# EAGLE design 11_JNZ (EAGLE 7.5.0)
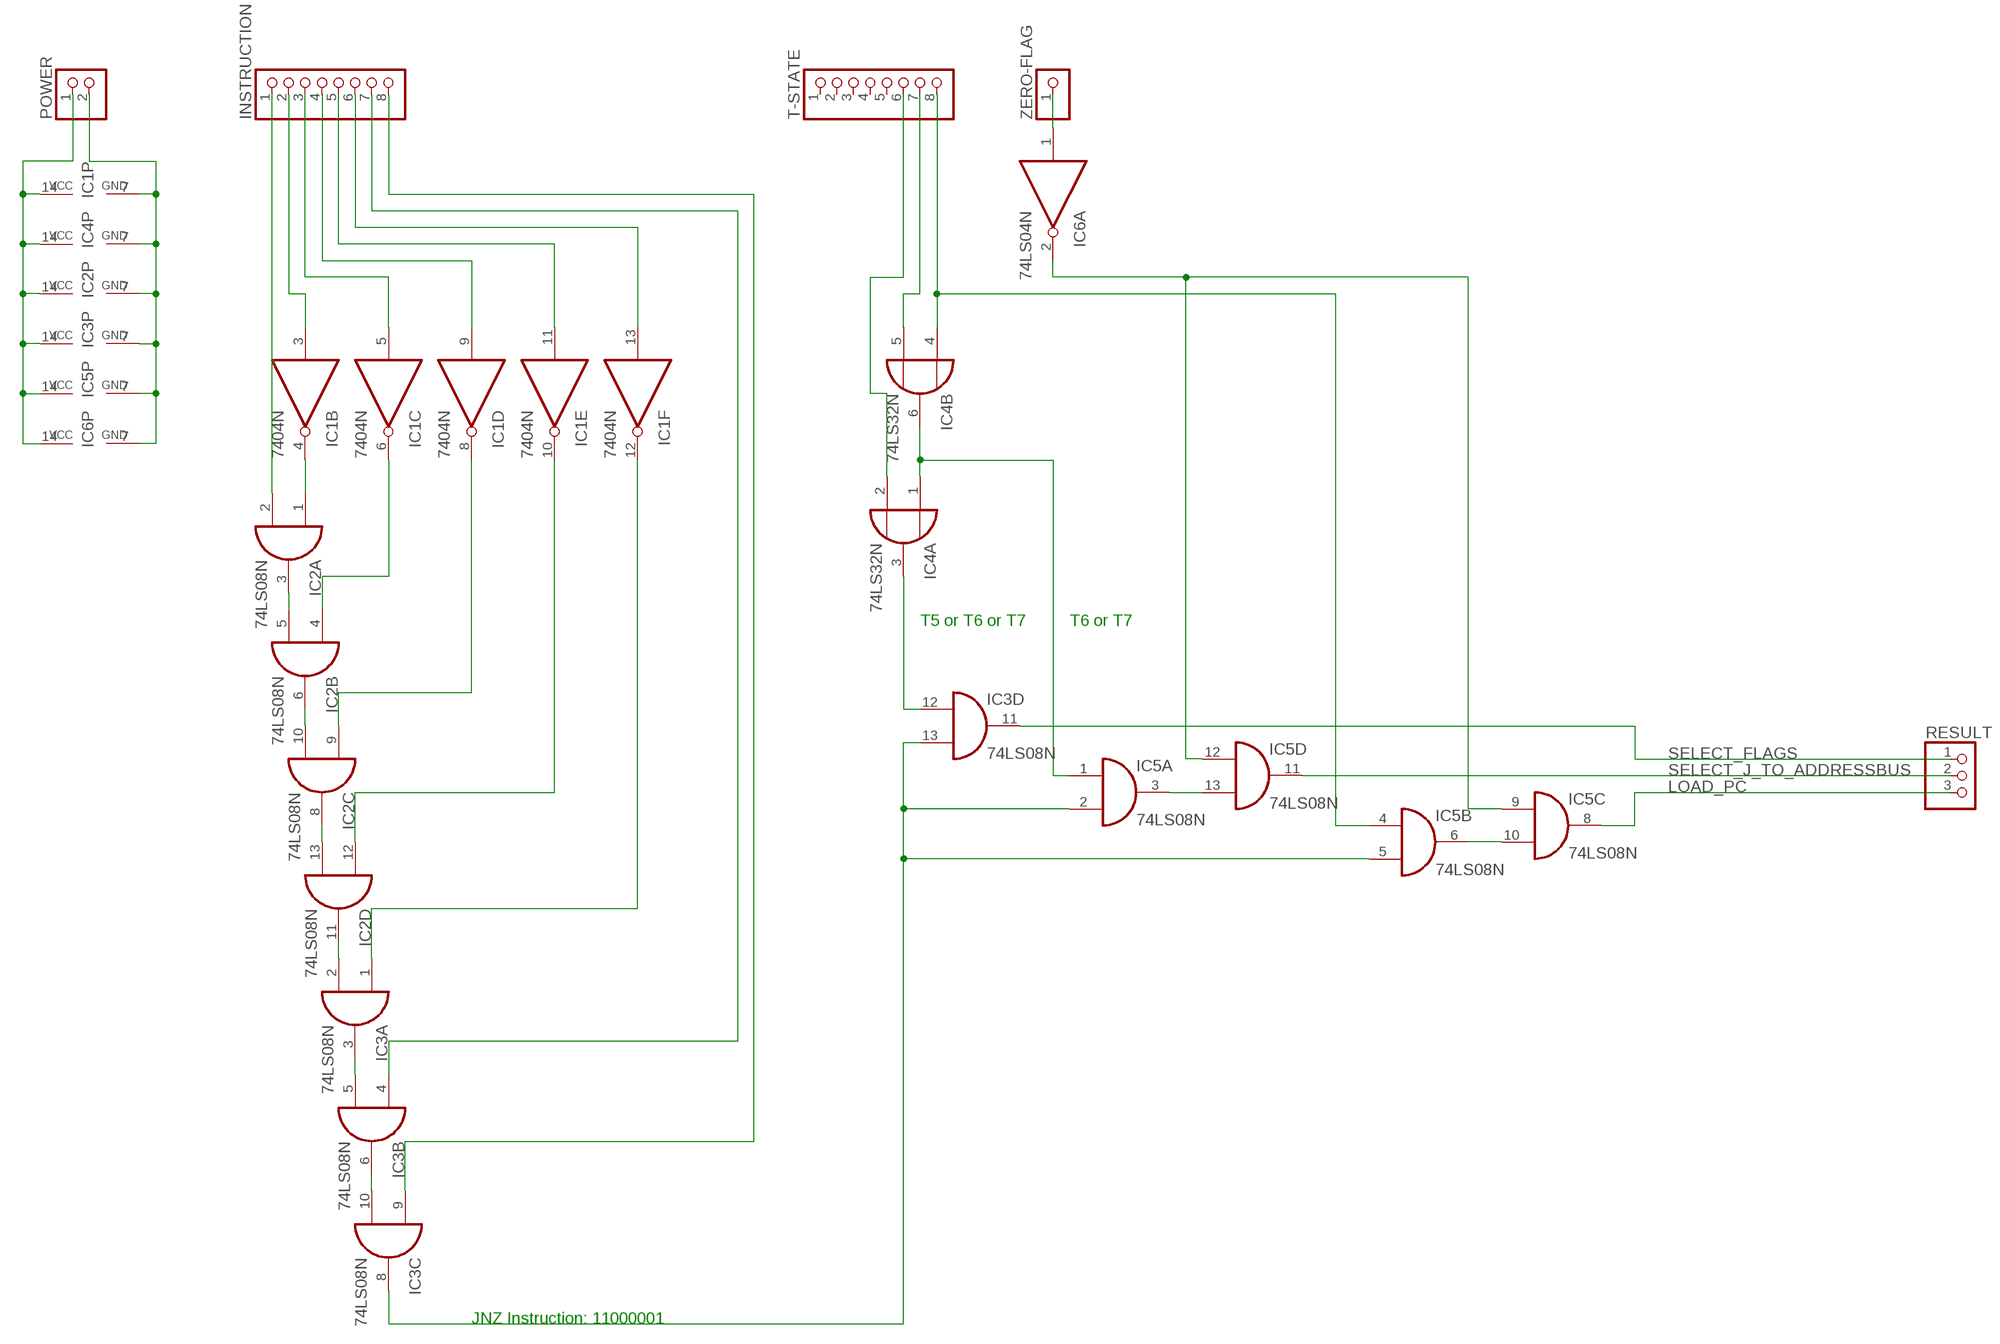
[diagram p0: schematic, sheet 1]

## Parts
IC1  7404N  [DIL14]
IC2  74LS08N  [DIL14]
IC3  74LS08N  [DIL14]
IC4  74LS32N  [DIL14]
IC5  74LS08N  [DIL14]
IC6  74LS04N  [DIL14]
INSTRUCTION  PINHD-1X8  [1X08]
POWER  PINHD-1X2  [1X02]
RESULT  PINHD-1X3  [1X03]
T-STATE  PINHD-1X8  [1X08]
ZERO-FLAG  PINHD-1X1  [1X01]

## Nets
GND: IC1.7(P:GND) IC2.7(P:GND) IC3.7(P:GND) IC4.7(P:GND) IC5.7(P:GND) IC6.7(P:GND) POWER.2
LOAD_PC: IC5.8(C:O) RESULT.3
N$1: IC6.1(A:I) ZERO-FLAG.1
N$2: IC1.3(B:I) INSTRUCTION.2
N$3: IC1.5(C:I) INSTRUCTION.3
N$4: IC1.9(D:I) INSTRUCTION.4
N$5: IC1.11(E:I) INSTRUCTION.5
N$6: IC1.13(F:I) INSTRUCTION.6
N$7: IC3.4(B:I0) INSTRUCTION.7
N$8: IC3.9(C:I0) INSTRUCTION.8
N$9: IC2.2(A:I1) INSTRUCTION.1
N$10: IC1.4(B:O) IC2.1(A:I0)
N$11: IC2.3(A:O) IC2.5(B:I1)
N$12: IC1.6(C:O) IC2.4(B:I0)
N$13: IC2.6(B:O) IC2.10(C:I1)
N$14: IC1.8(D:O) IC2.9(C:I0)
N$15: IC2.8(C:O) IC2.13(D:I1)
N$16: IC1.10(E:O) IC2.12(D:I0)
N$17: IC2.11(D:O) IC3.2(A:I1)
N$18: IC3.3(A:O) IC3.5(B:I1)
N$19: IC1.12(F:O) IC3.1(A:I0)
N$20: IC3.6(B:O) IC3.10(C:I1)
N$21: IC5.6(B:O) IC5.10(C:I1)
N$22: IC3.8(C:O) IC3.13(D:I1) IC5.2(A:I1) IC5.5(B:I1)
N$23: IC4.4(B:I0) IC5.4(B:I0) T-STATE.8
N$24: IC4.5(B:I1) T-STATE.7
N$25: IC4.1(A:I0) IC4.6(B:O) IC5.1(A:I0)
N$26: IC4.2(A:I1) T-STATE.6
N$27: IC3.12(D:I0) IC4.3(A:O)
N$28: IC5.9(C:I0) IC5.12(D:I0) IC6.2(A:O)
N$29: IC5.3(A:O) IC5.13(D:I1)
SELECT_FLAGS: IC3.11(D:O) RESULT.1
SELECT_J_TO_ADDRESSBUS: IC5.11(D:O) RESULT.2
VCC: IC1.14(P:VCC) IC2.14(P:VCC) IC3.14(P:VCC) IC4.14(P:VCC) IC5.14(P:VCC) IC6.14(P:VCC) POWER.1
Unconnected: IC1.1(A:I) IC1.2(A:O) IC4.8(C:O) IC4.9(C:I0) IC4.10(C:I1) IC4.11(D:O) IC4.12(D:I0) IC4.13(D:I1) IC6.3(B:I) IC6.4(B:O) IC6.5(C:I) IC6.6(C:O) IC6.8(D:O) IC6.9(D:I) IC6.10(E:O) IC6.11(E:I) IC6.12(F:O) IC6.13(F:I) T-STATE.1 T-STATE.2 T-STATE.3 T-STATE.4 T-STATE.5

## Notes on the sheet
- T5 or T6 or T7 | T6 or T7
- JNZ Instruction: 11000001

## Library data of the parts
IC1 IC6 = 74xx-eu:74*04: Hex INVERTER
IC2 IC3 IC5 = 74xx-eu:74*08: Quad 2-input AND gate
IC4 = 74xx-eu:74*32: Quad 2-input OR gate
INSTRUCTION T-STATE = pinhead:PINHD-1X8: PIN HEADER
POWER = pinhead:PINHD-1X2: PIN HEADER
RESULT = pinhead:PINHD-1X3: PIN HEADER
ZERO-FLAG = pinhead:PINHD-1X1: PIN HEADER

## Board
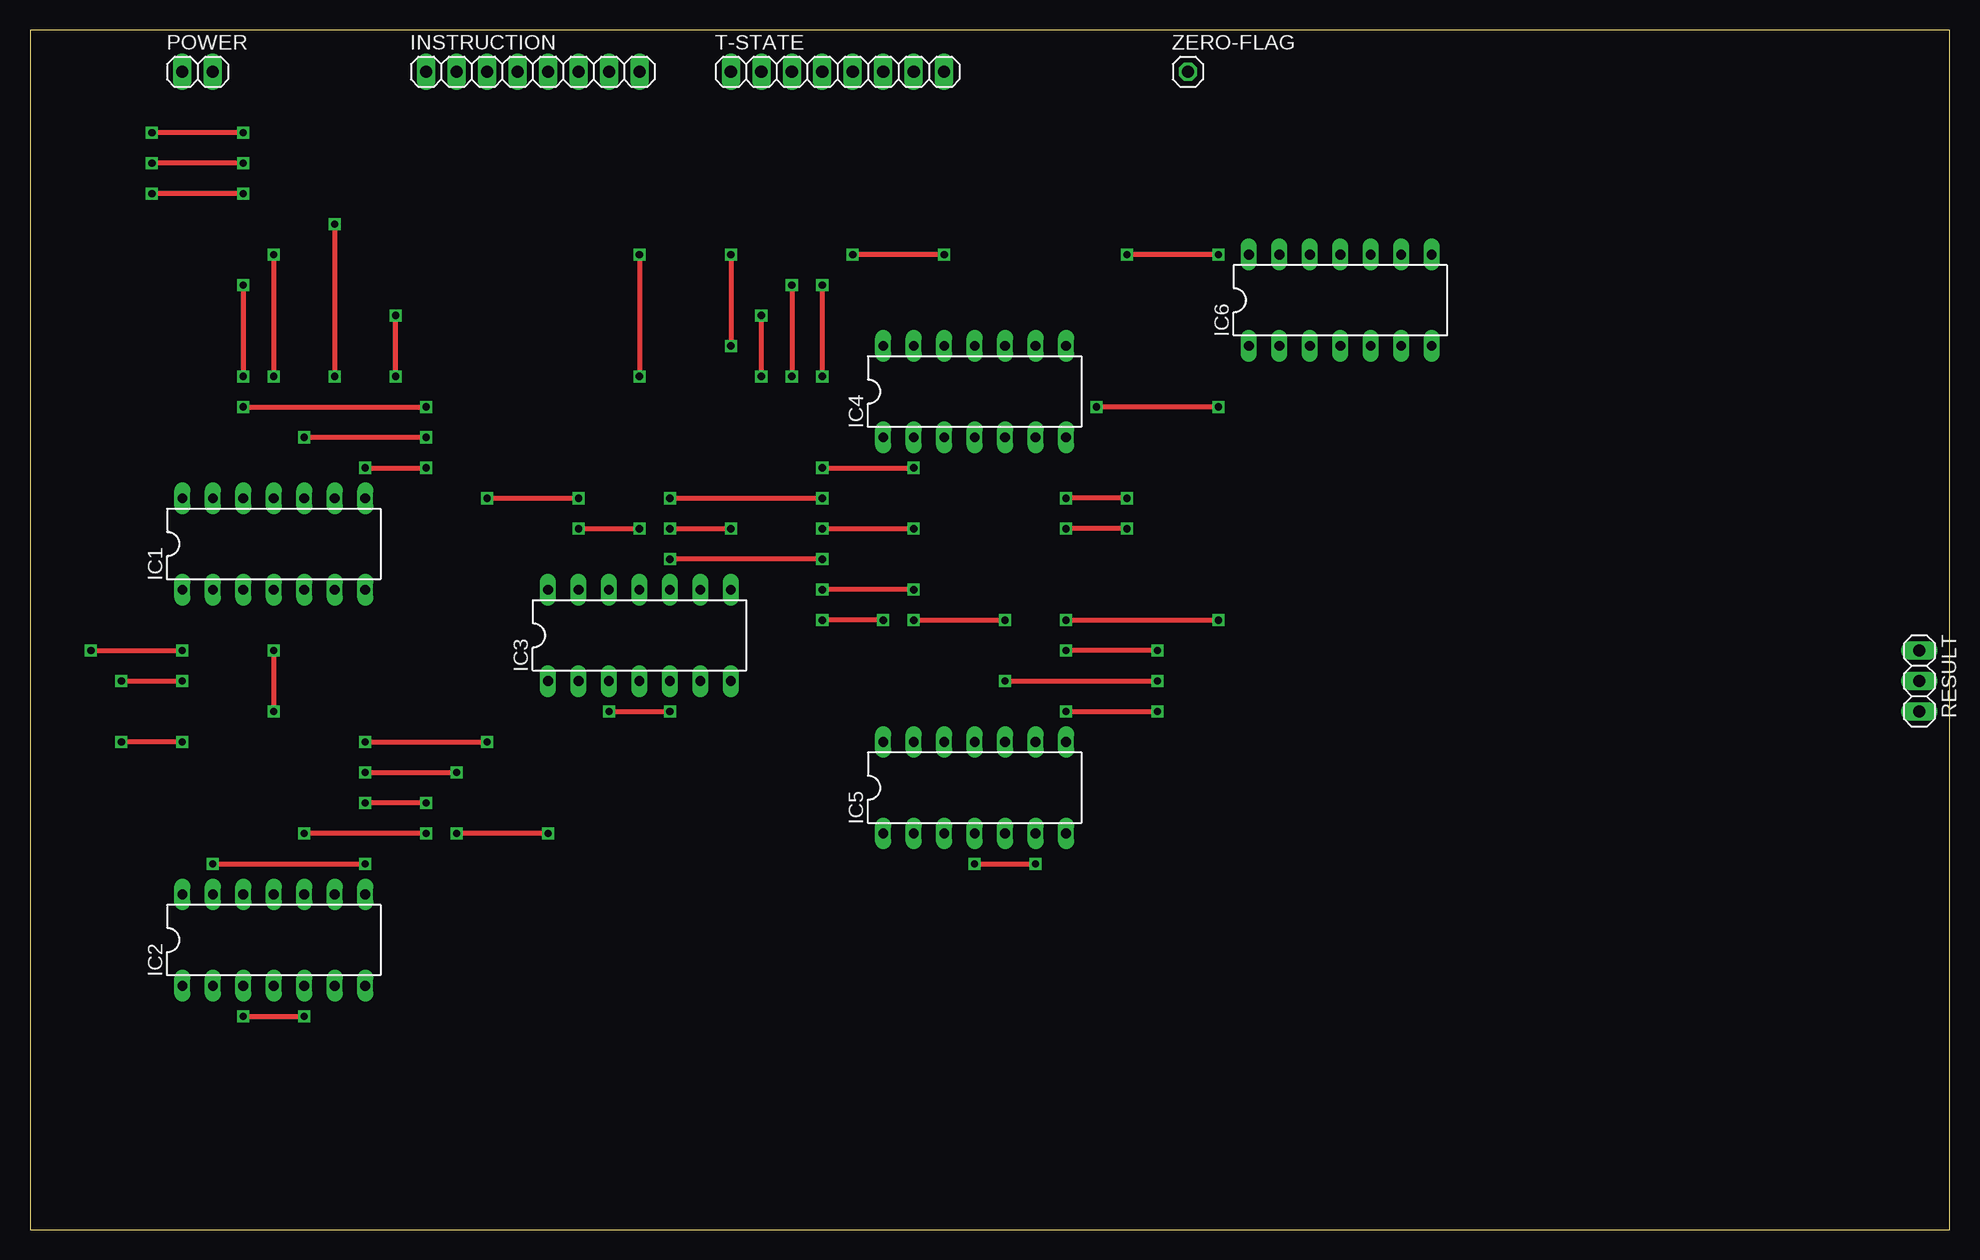
[diagram p1: board, top side]
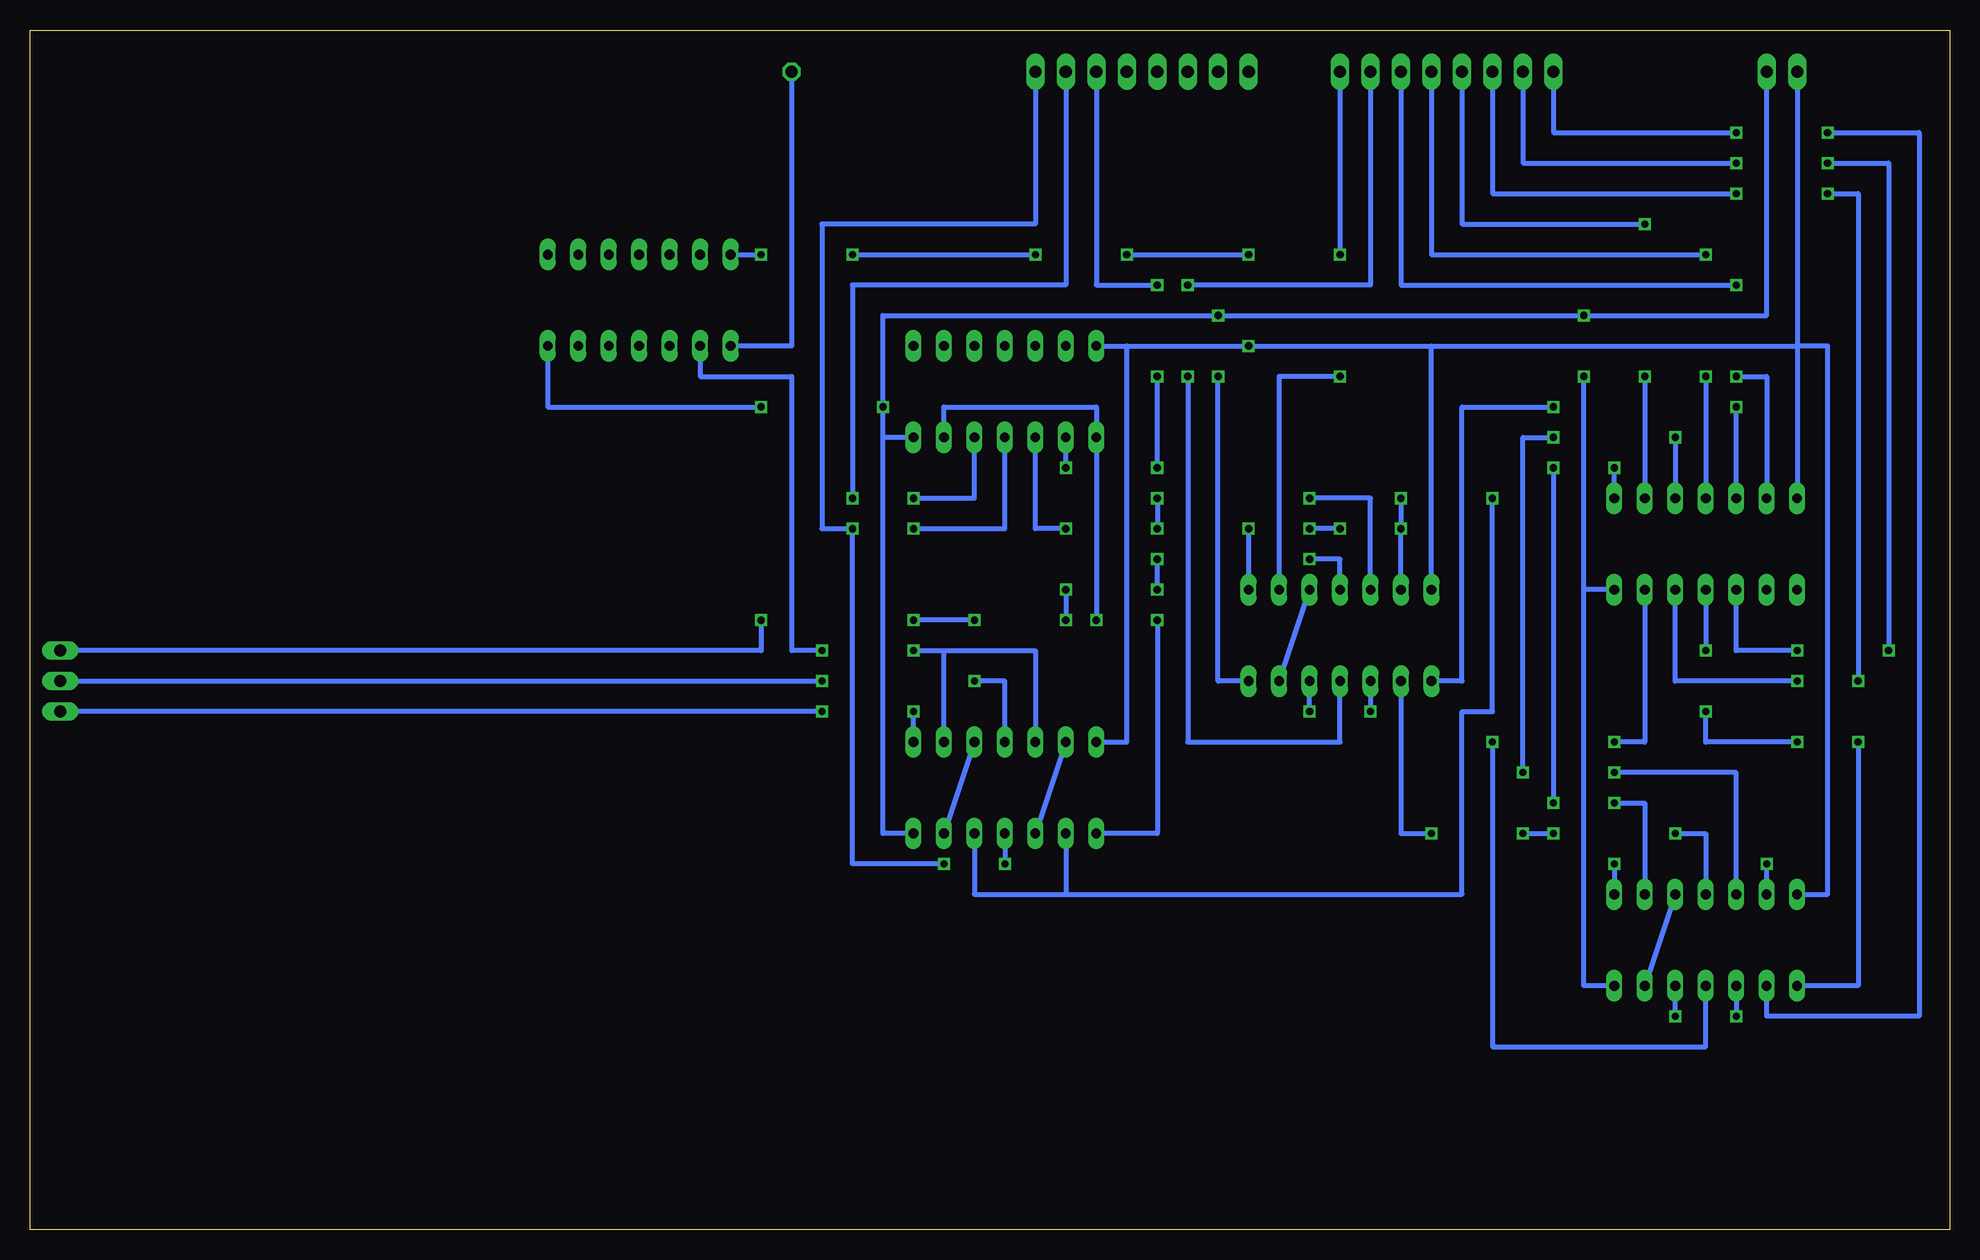
[diagram p2: board, bottom side, seen from below]

Size 160 x 100 mm. Coordinates in mm from the lower left corner, seen from the top.
Outline: 0,0 160,0 160,100 0,100 0,0
Copper layers (1*16): Top 0.035mm / dielectric 1.5mm / Bottom 0.035mm
Design rules "default": minimum track width 10mil, minimum drill 24mil, track to track 8mil, track to pad 8mil, pad to pad 8mil, via to via 8mil, smd to smd 8mil, copper to edge 40mil, drill to drill 8mil, minimum pad ring 10mil, minimum via ring 8mil, stop-mask expansion 4mil, vias tented up to drill 0mil, thermal gap 10mil

### Footprints (pad centres in the part's own frame; a part is rotated, then mirrored left to right if it is on the bottom)
DIL14 = drill 0.813 long: 1 -7.62,-3.81; 2 -5.08,-3.81; 3 -2.54,-3.81; 4 0,-3.81; 5 2.54,-3.81; 6 5.08,-3.81; 7 7.62,-3.81; 8 7.62,3.81; 9 5.08,3.81; 10 2.54,3.81; 11 0,3.81; 12 -2.54,3.81; 13 -5.08,3.81; 14 -7.62,3.81
1X08 = drill 1.016 long: 1 -8.89,0; 2 -6.35,0; 3 -3.81,0; 4 -1.27,0; 5 1.27,0; 6 3.81,0; 7 6.35,0; 8 8.89,0
1X02 = drill 1.016 long: 1 -1.27,0; 2 1.27,0
1X03 = drill 1.016 long: 1 -2.54,0; 2 0,0; 3 2.54,0
1X01 = drill 1.016 octagon: 1 0,0

### Placement (x,y rotation side)
IC1  20.32,57.15 0 top
IC2  20.32,24.13 0 top
IC3  50.8,49.53 0 top
IC4  78.74,69.85 0 top
IC5  78.74,36.83 0 top
IC6  109.22,77.47 0 top
INSTRUCTION  41.91,96.52 0 top
POWER  13.97,96.52 0 top
RESULT  157.48,45.72 270 top
T-STATE  67.31,96.52 0 top
ZERO-FLAG  96.52,96.52 0 top

### Tracks (layer width: path | path; a pad name or v marks a point on that pad's centre or on a via)
GND  (via drill 0.6)
  Top 0.406: v30.48,71.12 v30.48,76.2 | v60.96,71.12 v60.96,76.2 | v99.06,68.58 v88.9,68.58
  Bottom 0.406: IC1.7 30.48,53.34 | 30.48,53.34 v30.48,71.12 | POWER.2 15.24,76.2 v30.48,76.2 v60.96,76.2 88.9,76.2 v88.9,68.58 88.9,66.04 | IC3.7 60.96,45.72 v60.96,71.12 | IC4.7 88.9,66.04 | IC2.7 30.48,20.32 30.48,53.34 | IC5.7 88.9,33.02 88.9,66.04 | IC6.7 116.84,68.58 v99.06,68.58
LOAD_PC  (via drill 0.6)
  Top 0.406: v86.36,43.18 v93.98,43.18
  Bottom 0.406: IC5.8 v86.36,43.18 | v93.98,43.18 RESULT.3
N$1
  Bottom 0.406: ZERO-FLAG.1 96.52,73.66 IC6.1
N$2  (via drill 0.6)
  Top 0.406: v17.78,88.9 v10.16,88.9 | v5.08,48.26 v12.7,48.26
  Bottom 0.406: INSTRUCTION.2 35.56,88.9 v17.78,88.9 | v10.16,88.9 5.08,88.9 v5.08,48.26 | v12.7,48.26 17.78,48.26 IC1.3
N$3  (via drill 0.6)
  Top 0.406: v17.78,86.36 v10.16,86.36 | v7.62,45.72 v12.7,45.72
  Bottom 0.406: INSTRUCTION.3 38.1,86.36 v17.78,86.36 | v10.16,86.36 7.62,86.36 v7.62,45.72 | v12.7,45.72 22.86,45.72 IC1.5
N$4  (via drill 0.6)
  Top 0.406: v25.4,83.82 v25.4,71.12
  Bottom 0.406: INSTRUCTION.4 40.64,83.82 v25.4,83.82 | v25.4,71.12 IC1.9
N$5  (via drill 0.6)
  Top 0.406: v20.32,81.28 v20.32,71.12
  Bottom 0.406: INSTRUCTION.5 43.18,81.28 v20.32,81.28 | v20.32,71.12 IC1.11
N$6  (via drill 0.6)
  Top 0.406: v17.78,78.74 v17.78,71.12
  Bottom 0.406: INSTRUCTION.6 45.72,78.74 v17.78,78.74 | v17.78,71.12 15.24,71.12 IC1.13
N$7  (via drill 0.6)
  Top 0.406: v63.5,78.74 v63.5,71.12
  Bottom 0.406: INSTRUCTION.7 48.26,78.74 v63.5,78.74 | v63.5,71.12 63.5,40.64 50.8,40.64 IC3.4
N$8  (via drill 0.6)
  Top 0.406: v50.8,81.28 v50.8,71.12
  Bottom 0.406: INSTRUCTION.8 v50.8,81.28 | v50.8,71.12 55.88,71.12 IC3.9
N$9  (via drill 0.6)
  Top 0.406: v17.78,91.44 v10.16,91.44
  Bottom 0.406: INSTRUCTION.1 33.02,91.44 v17.78,91.44 | v10.16,91.44 2.54,91.44 2.54,17.78 15.24,17.78 IC2.2
N$10  (via drill 0.6)
  Top 0.406: v20.32,48.26 v20.32,43.18 | v12.7,40.64 v7.62,40.64
  Bottom 0.406: IC1.4 v20.32,48.26 | v7.62,40.64 7.62,20.32 IC2.1 | v12.7,40.64 20.32,40.64 v20.32,43.18
N$11  (via drill 0.6)
  Top 0.406: v17.78,17.78 v22.86,17.78
  Bottom 0.406: IC2.3 v17.78,17.78 | v22.86,17.78 IC2.5
N$12  (via drill 0.6)
  Top 0.406: v27.94,40.64 v38.1,40.64
  Bottom 0.406: IC1.6 25.4,40.64 v27.94,40.64 | v38.1,40.64 38.1,15.24 20.32,15.24 IC2.4
N$13
  Bottom 0.406: IC2.10 IC2.6
N$14  (via drill 0.6)
  Top 0.406: v27.94,63.5 v33.02,63.5 | v33.02,35.56 v27.94,35.56
  Bottom 0.406: IC1.8 v27.94,63.5 | v33.02,63.5 v33.02,35.56 | v27.94,35.56 25.4,35.56 IC2.9
N$15  (via drill 0.6)
  Top 0.406: v15.24,30.48 v27.94,30.48
  Bottom 0.406: IC2.13 v15.24,30.48 | v27.94,30.48 IC2.8
N$16  (via drill 0.6)
  Top 0.406: v27.94,38.1 v35.56,38.1 | v33.02,66.04 v22.86,66.04
  Bottom 0.406: IC2.12 17.78,38.1 v27.94,38.1 | v35.56,38.1 35.56,66.04 v33.02,66.04 | v22.86,66.04 IC1.10
N$17  (via drill 0.6)
  Top 0.406: v43.18,33.02 v35.56,33.02 | v33.02,33.02 v22.86,33.02
  Bottom 0.406: IC3.2 45.72,33.02 v43.18,33.02 | v22.86,33.02 20.32,33.02 IC2.11 | v35.56,33.02 v33.02,33.02
N$18  (via drill 0.6)
  Top 0.406: v48.26,43.18 v53.34,43.18
  Bottom 0.406: IC3.3 v48.26,43.18 | v53.34,43.18 IC3.5
N$19  (via drill 0.6)
  Top 0.406: v17.78,68.58 v33.02,68.58
  Bottom 0.406: IC1.12 v17.78,68.58 | IC3.1 40.64,45.72 40.64,68.58 v33.02,68.58
N$20
  Bottom 0.406: IC3.10 IC3.6
N$21
  Bottom 0.406: IC5.10 IC5.6
N$22  (via drill 0.6)
  Top 0.406: v45.72,58.42 v50.8,58.42 | v53.34,58.42 v58.42,58.42 | v38.1,60.96 v45.72,60.96
  Bottom 0.406: IC3.13 v45.72,58.42 v45.72,60.96 | v50.8,58.42 v53.34,58.42 | v58.42,58.42 IC3.8 | IC5.5 81.28,27.94 73.66,27.94 | IC5.2 73.66,27.94 | 73.66,27.94 40.64,27.94 40.64,43.18 38.1,43.18 v38.1,60.96
N$23  (via drill 0.6)
  Top 0.406: v91.44,58.42 v86.36,58.42 | v78.74,30.48 v83.82,30.48
  Bottom 0.406: T-STATE.8 76.2,83.82 93.98,83.82 93.98,58.42 v91.44,58.42 91.44,30.48 v83.82,30.48 | v86.36,58.42 78.74,58.42 IC4.4 | IC5.4 v78.74,30.48
N$24  (via drill 0.6)
  Top 0.406: v91.44,60.96 v86.36,60.96
  Bottom 0.406: T-STATE.7 73.66,78.74 91.44,78.74 v91.44,60.96 | v86.36,60.96 81.28,60.96 IC4.5
N$25  (via drill 0.6)
  Top 0.406: v71.12,50.8 v66.04,50.8
  Bottom 0.406: IC4.6 83.82,68.58 71.12,68.58 IC4.1 v71.12,50.8 | v66.04,50.8 66.04,33.02 IC5.1
N$26  (via drill 0.6)
  Top 0.406: v66.04,78.74 v66.04,71.12 | v66.04,63.5 v73.66,63.5
  Bottom 0.406: T-STATE.6 71.12,78.74 v66.04,78.74 | v73.66,63.5 IC4.2 | v66.04,63.5 v66.04,71.12
N$27  (via drill 0.6)
  Top 0.406: v53.34,60.96 v66.04,60.96 | v66.04,58.42 v73.66,58.42
  Bottom 0.406: IC3.12 48.26,60.96 v53.34,60.96 | v66.04,60.96 v66.04,58.42 | v73.66,58.42 76.2,58.42 IC4.3
N$28  (via drill 0.6)
  Top 0.406: v93.98,48.26 v86.36,48.26
  Bottom 0.406: v86.36,48.26 83.82,48.26 | 83.82,48.26 76.2,48.26 IC5.12 | IC5.9 83.82,48.26 | v93.98,48.26 96.52,48.26 96.52,71.12 104.14,71.12 IC6.2
N$29
  Bottom 0.406: IC5.13 IC5.3
SELECT_FLAGS  (via drill 0.6)
  Top 0.406: v73.66,50.8 v81.28,50.8 | v86.36,50.8 v99.06,50.8 | v73.66,53.34 v66.04,53.34 | v66.04,55.88 v53.34,55.88
  Bottom 0.406: v73.66,53.34 v73.66,50.8 | v81.28,50.8 v86.36,50.8 | IC3.11 50.8,55.88 v53.34,55.88 | v66.04,53.34 v66.04,55.88 | v99.06,50.8 99.06,48.26 RESULT.1
SELECT_J_TO_ADDRESSBUS  (via drill 0.6)
  Top 0.406: v81.28,45.72 v93.98,45.72
  Bottom 0.406: IC5.11 78.74,45.72 v81.28,45.72 | RESULT.2 v93.98,45.72
VCC  (via drill 0.6)
  Top 0.406: v99.06,81.28 v91.44,81.28 | v76.2,81.28 v68.58,81.28 | v58.42,81.28 v58.42,73.66
  Bottom 0.406: POWER.1 12.7,73.66 | 12.7,73.66 IC1.14 | IC3.14 43.18,73.66 | 43.18,73.66 12.7,73.66 | IC2.14 10.16,27.94 10.16,73.66 12.7,73.66 | IC4.14 68.58,73.66 | 68.58,73.66 v58.42,73.66 43.18,73.66 | IC5.14 68.58,40.64 68.58,73.66 | IC6.14 v99.06,81.28 | v91.44,81.28 v76.2,81.28 | v68.58,81.28 v58.42,81.28